# EAGLE schematic ALUDecoderGateArrayv2 (EAGLE 6.5.0)
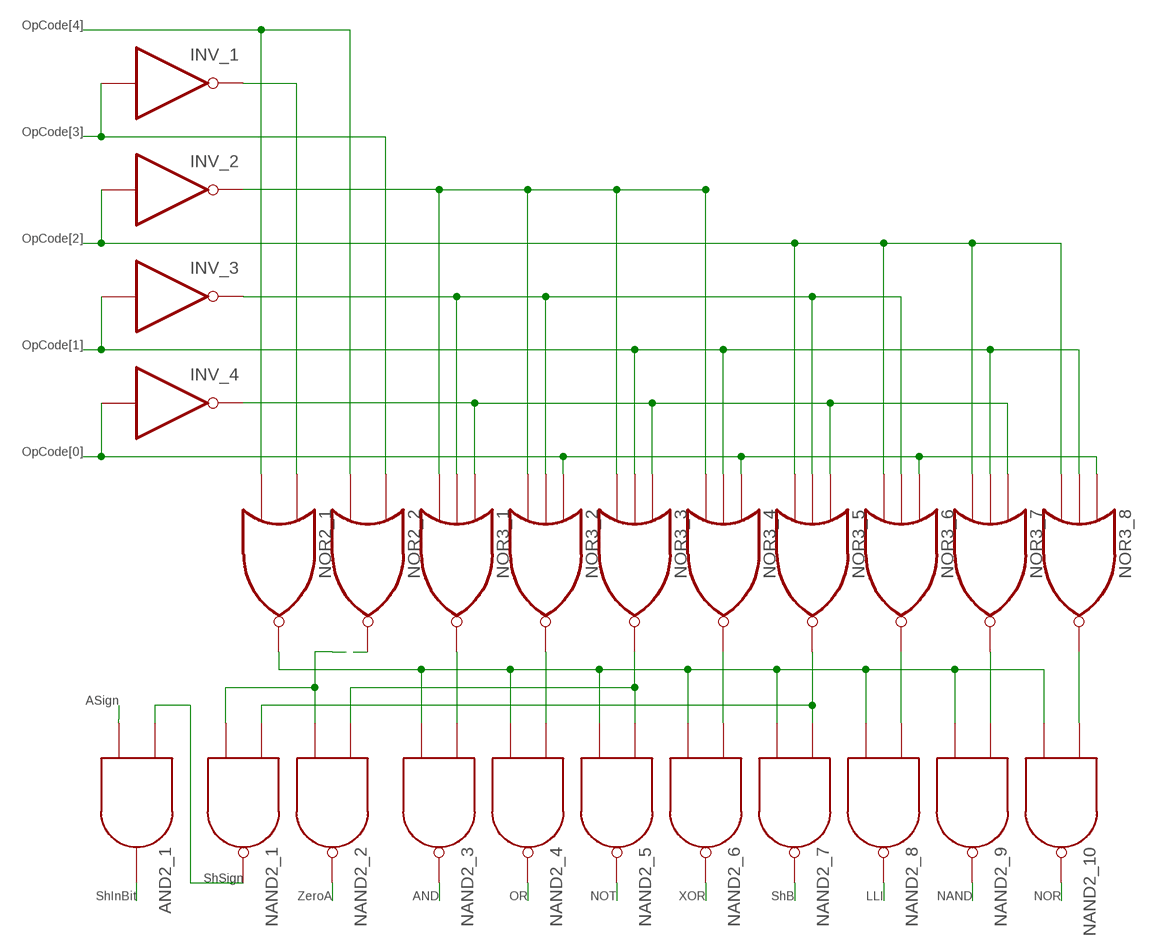
[diagram p0: schematic, sheet 1]

## Parts
AND2_1  AND2  [3PIN]
INV_1  INV  [3PIN]
INV_2  INV  [3PIN]
INV_3  INV  [3PIN]
INV_4  INV  [3PIN]
NAND2_1  NAND2  [3PIN]
NAND2_2  NAND2  [3PIN]
NAND2_3  NAND2  [3PIN]
NAND2_4  NAND2  [3PIN]
NAND2_5  NAND2  [3PIN]
NAND2_6  NAND2  [3PIN]
NAND2_7  NAND2  [3PIN]
NAND2_8  NAND2  [3PIN]
NAND2_9  NAND2  [3PIN]
NAND2_10  NAND2  [3PIN]
NOR2_1  NOR2  [3PIN]
NOR2_2  NOR2  [3PIN]
NOR3_1  NOR3  [5PIN]
NOR3_2  NOR3  [5PIN]
NOR3_3  NOR3  [5PIN]
NOR3_4  NOR3  [5PIN]
NOR3_5  NOR3  [5PIN]
NOR3_6  NOR3  [5PIN]
NOR3_7  NOR3  [5PIN]
NOR3_8  NOR3  [5PIN]

## Nets
N$1: NOR2_1.P$2(I1) NOR2_2.P$2(I1)
N$2: AND2_1.P$2(I1)
N$3: INV_1.P$2(O) NOR2_1.P$1(I0)
N$4: NOR2_2.P$1(I0)
N$5: INV_2.P$1(I) NOR3_5.P$2(I1) NOR3_6.P$2(I1) NOR3_7.P$2(I1) NOR3_8.P$2(I1)
N$6: INV_2.P$2(O) NOR3_1.P$2(I1) NOR3_2.P$2(I1) NOR3_3.P$2(I1) NOR3_4.P$2(I1)
N$7: INV_3.P$2(O) NOR3_1.P$3(I2) NOR3_2.P$3(I2) NOR3_5.P$3(I2) NOR3_6.P$3(I2)
N$8: AND2_1.P$3(O)
N$9: INV_4.P$2(O) NOR3_1.P$1(I0) NOR3_3.P$1(I0) NOR3_5.P$1(I0) NOR3_7.P$1(I0)
N$10: INV_4.P$1(I) NOR3_2.P$1(I0) NOR3_4.P$1(I0) NOR3_6.P$1(I0) NOR3_8.P$1(I0)
N$11: INV_3.P$1(I) NOR3_3.P$3(I2) NOR3_4.P$3(I2) NOR3_7.P$3(I2) NOR3_8.P$3(I2)
N$12: NAND2_3.P$2(I1) NAND2_4.P$2(I1) NAND2_5.P$2(I1) NAND2_6.P$2(I1) NAND2_7.P$2(I1) NAND2_8.P$2(I1) NAND2_9.P$2(I1) NAND2_10.P$2(I1) NOR2_1.P$3(O)
N$13: NAND2_2.P$1(A) NAND2_5.P$1(A)
N$14: NAND2_1.P$1(A) NAND2_7.P$1(A)
N$15: NAND2_10.P$1(A)
N$16: NAND2_3.P$1(A)
N$17: NAND2_4.P$1(A)
N$18: NAND2_6.P$1(A)
N$19: NAND2_8.P$1(A)
N$20: NAND2_9.P$1(A)
N$21: NAND2_2.P$3(O)
N$22: AND2_1.P$1(A) NAND2_1.P$3(O)
N$23: NAND2_1.P$2(I1) NAND2_2.P$2(I1)
N$24: NAND2_3.P$3(O)
N$25: NAND2_4.P$3(O)
N$26: NAND2_5.P$3(O)
N$27: NAND2_6.P$3(O)
N$28: NAND2_7.P$3(O)
N$29: NAND2_8.P$3(O)
N$30: NAND2_9.P$3(O)
N$31: NAND2_10.P$3(O)
Unconnected: INV_1.P$1(I) NOR2_2.P$3(O) NOR3_1.P$4(O) NOR3_2.P$4(O) NOR3_3.P$4(O) NOR3_4.P$4(O) NOR3_5.P$4(O) NOR3_6.P$4(O) NOR3_7.P$4(O) NOR3_8.P$4(O)

## Notes on the sheet
- OpCode[4]
- OpCode[3]
- OpCode[2]
- OpCode[1]
- OpCode[0]
- ASign
- ShSign
- ShInBit | ZeroA | AND | OR | NOT | XOR | ShB | LLI | NAND | NOR

## Library data of the parts
AND2_1 = c035u:AND2
INV_1-INV_4 = c035u:INV
NAND2_1-NAND2_10 = c035u:NAND2
NOR2_1 NOR2_2 = c035u:NOR2
NOR3_1-NOR3_8 = c035u:NOR3